# Altium schematic sheet H-Bridge.SchDoc
size A4
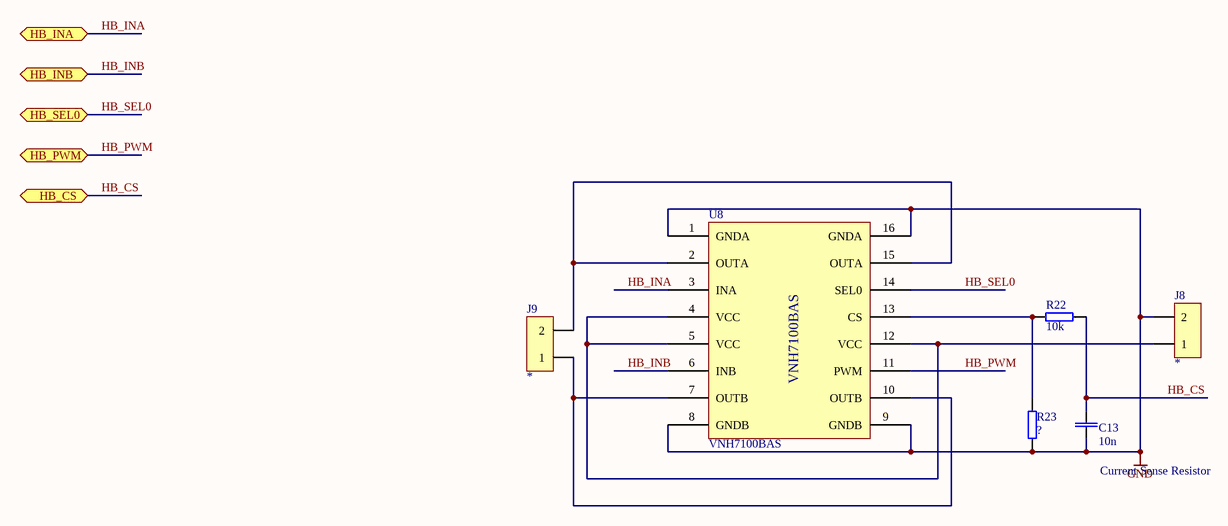
[diagram p0: H-Bridge.SchDoc]

## Parts
C13  10n  [CAP 0805]
J8  *  [PTR_AKZ350]
J9  *  [PTR_AKZ350]
R22  10k  [RES 0805]
R23  ?  [RES 0805]
U8  VNH7100BAS  [SO16N]

## Ports
HB_CS (bidir), HB_INA (bidir), HB_INB (bidir), HB_PWM (bidir), HB_SEL0 (bidir)

## Nets
GND: C13.1 J8.2 R23.2 U8.1(GNDA) U8.8(GNDB) U8.9(GNDB) U8.16(GNDA)
HB_CS: C13.2 R22.2 ; port HB_CS
HB_INA: U8.3(INA) ; port HB_INA
HB_INB: U8.6(INB) ; port HB_INB
HB_PWM: U8.11(PWM) ; port HB_PWM
HB_SEL0: U8.14(SEL0) ; port HB_SEL0
NetJ8_1: J8.1 U8.4(VCC) U8.5(VCC) U8.12(VCC)
NetJ9_1: J9.1 U8.7(OUTB) U8.10(OUTB)
NetJ9_2: J9.2 U8.2(OUTA) U8.15(OUTA)
NetR22_1: R22.1 R23.1 U8.13(CS)

## Notes on the sheet
- Current Sense Resistor

## Library data of the parts
C13 = CAP: NON POLARIZED CAPACITOR; VALUE: 10n; Reference: 82-01-25; Supplier: LOMEX
J8 J9 = HEADER2: 2 PIN HEADER; REFERENCE ID: *; DISTRIBUTOR: *; VALUE: *
R22 R23 = RES: RESISTOR; REFERENCE ID: *; DISTRIBUTOR: *
  R22: VALUE: 10k
  R23: VALUE: ?
U8 = VNH7100BAS: Automotive fully integrated H-bridge motor driver; Name: VNH7100BAS; Datasheet: https://www.st.com/resource/en/datasheet/dm00314832.pdf